# EAGLE design SmartLURE (EAGLE 6.5.0)
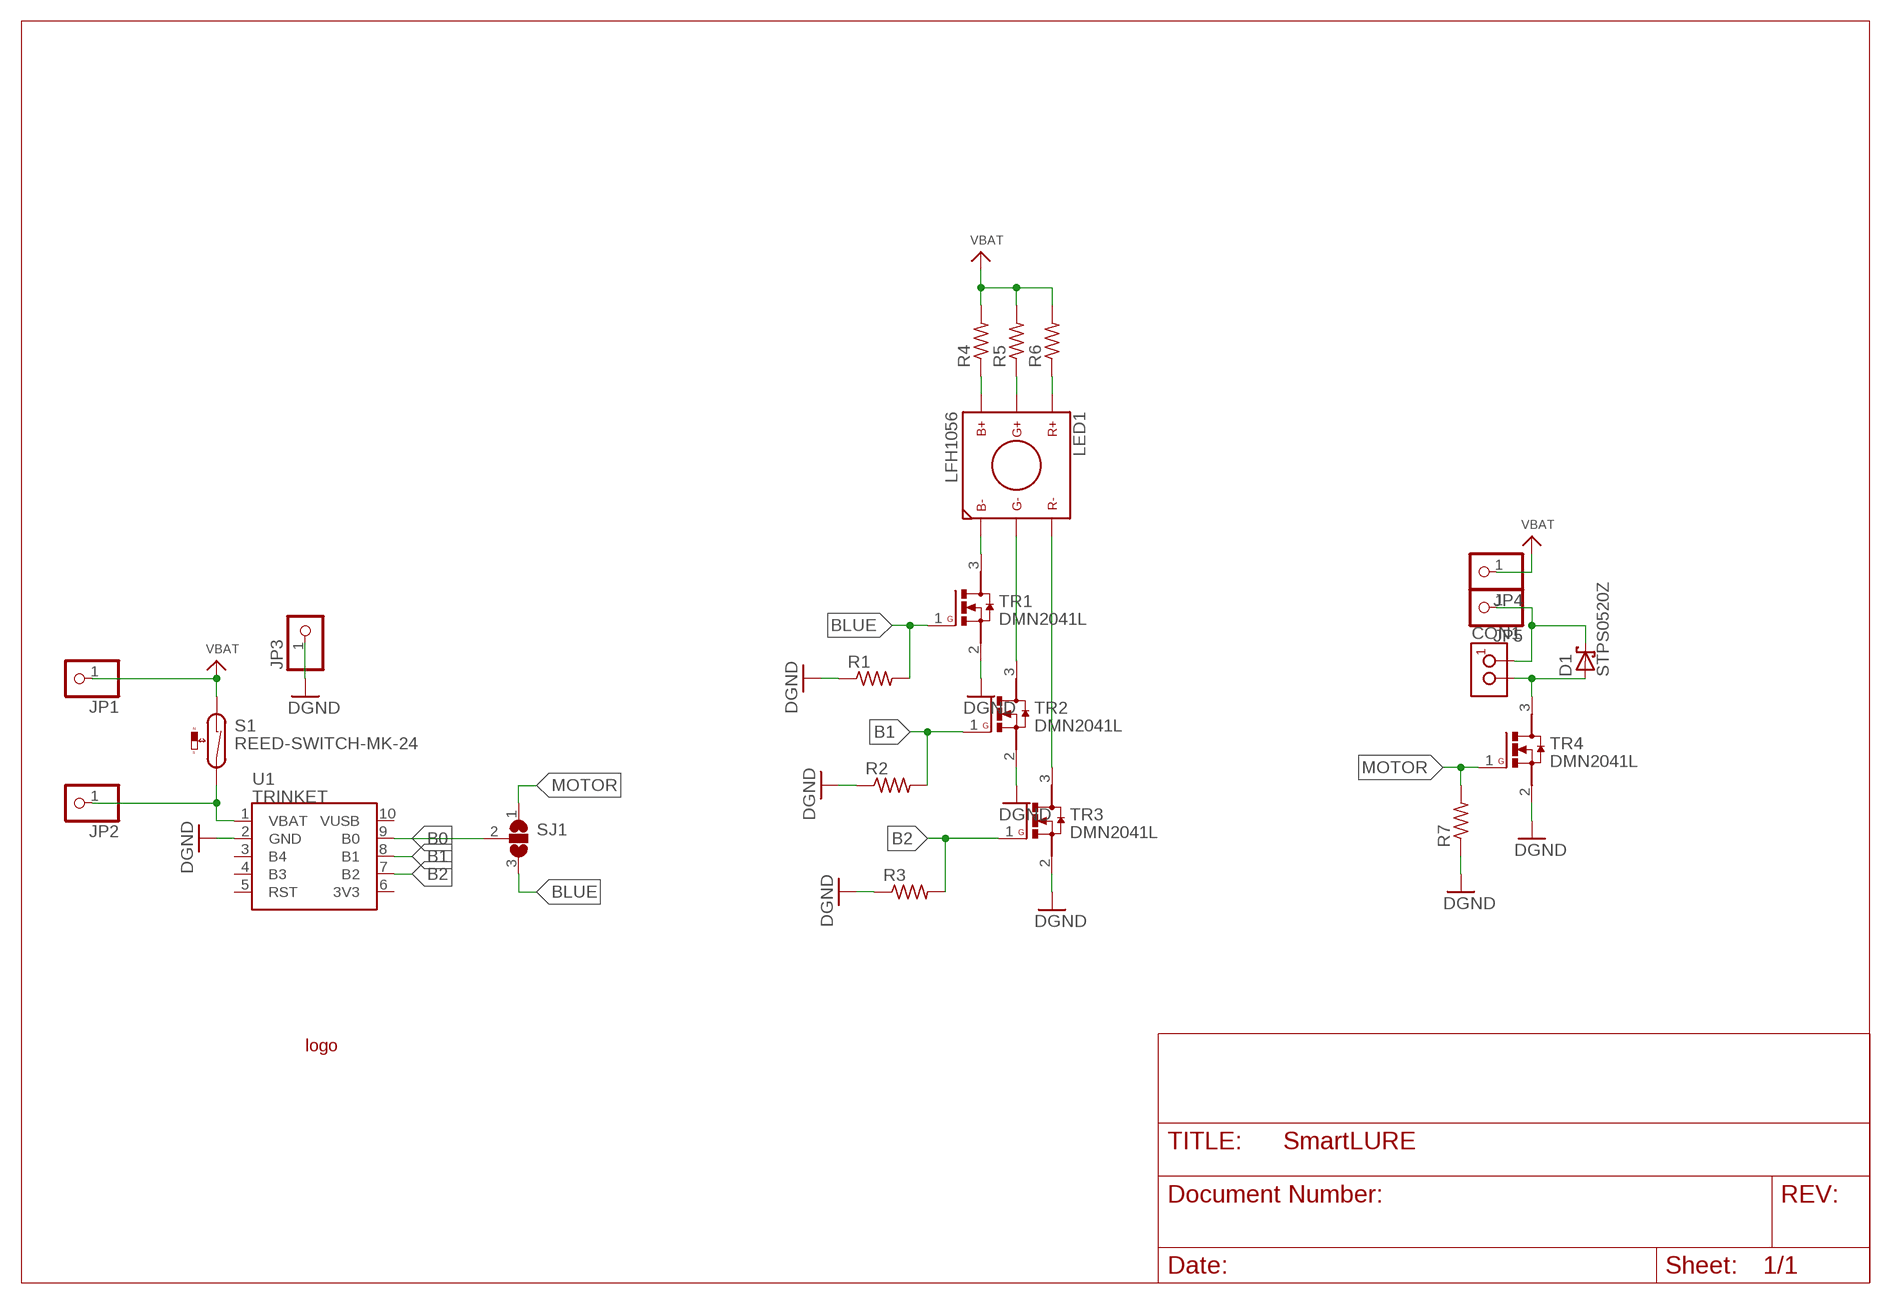
[diagram p0: schematic, sheet 1]

## Parts
CON1  PINHEADER_1.27  [PINHEADER_1.27]
D1  STPS0520Z  [SOD-123]
JP1  PINHD-1X1CB  [1X01-CLEANBIG]
JP2  PINHD-1X1CB  [1X01-CLEANBIG]
JP3  PINHD-1X1CB  [1X01-CLEANBIG]
JP4  PINHD-1X1CB  [1X01-CLEANBIG]
JP5  PINHD-1X1CB  [1X01-CLEANBIG]
LED1  LFH1056  [LFH1056]
LOGO1  GRADEFREELOGO-10  [GRADEFREELOGO-10]
R1  R0603(1608)  [R0603(1608)]
R2  R0603(1608)  [R0603(1608)]
R3  R0603(1608)  [R0603(1608)]
R4  R0603(1608)  [R0603(1608)]
R5  R0603(1608)  [R0603(1608)]
R6  R0603(1608)  [R0603(1608)]
R7  R0603(1608)  [R0603(1608)]
S1  REED-SWITCH-MK-24  [MK24]
SJ1  SJ2W  [SJ_2]
TR1  DMN2041L  [SOT23]
TR2  DMN2041L  [SOT23]
TR3  DMN2041L  [SOT23]
TR4  DMN2041L  [SOT23]
U1  TRINKET  [TRINKET]

## Nets
B0: SJ1.2 U1.9(B0)
B1: R2.2 TR2.1(G) U1.8(B1)
B2: R3.2 TR3.1(G) U1.7(B2)
BLUE: R1.2 SJ1.3 TR1.1(G)
DGND: JP3.1 R1.1 R2.1 R3.1 R7.1 TR1.2(S) TR2.2(S) TR3.2(S) TR4.2(S) U1.2(GND)
MOTOR: R7.2 SJ1.1 TR4.1(G)
N$1: LED1.B+ R4.1
N$2: LED1.G+ R5.1
N$3: LED1.R+ R6.1
N$4: LED1.B- TR1.3(D)
N$5: LED1.G- TR2.3(D)
N$6: LED1.R- TR3.3(D)
N$7: JP2.1 S1.2 U1.1(VBAT)
N$8: CON1.P$1 D1.C JP5.1
N$10: CON1.P$2 D1.A TR4.3(D)
VBAT: JP1.1 JP4.1 R4.2 R5.2 R6.2 S1.1
Unconnected: U1.3(B4) U1.4(B3) U1.5(RST) U1.6(3V3) U1.10(VUSB)

## Library data of the parts
CON1 = PinHeader:PINHEADER_1.27: 1.27mm pitch
D1 = GradeFreeEngineer:STPS0520Z: We use STPS0520Z by st.com diode for solar cell schottky diode. If = 500mA Vrrm = 20V Vf max = 0.32V
JP1-JP5 = adafruit:PINHD-1X1: Pin header 1x1 for 0.1" spacing With round pins
LED1 = GradeFreeEngineer:LFH1056: Luxpia LFH1056
LOGO1 = GradeFreeEngineer:GRADEFREELOGO
R1-R7 = GradeFreeEngineer:R
S1 = GradeFreeEngineer:REED-SWITCH-: Reed Sensor
SJ1 = jumper:SJ2W: SMD solder JUMPER
TR1-TR4 = GradeFreeEngineer:DMN2041L
U1 = GradeFreeEngineer:TRINKET

## Board
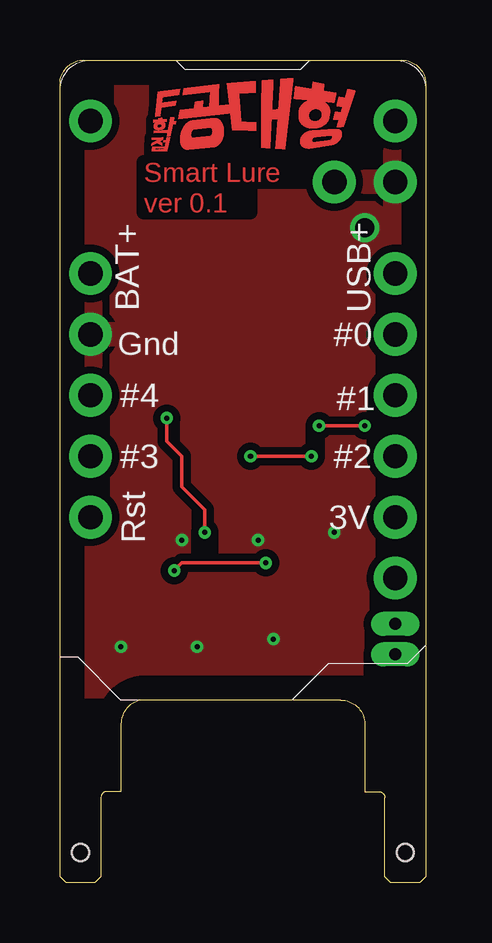
[diagram p1: board, top side]
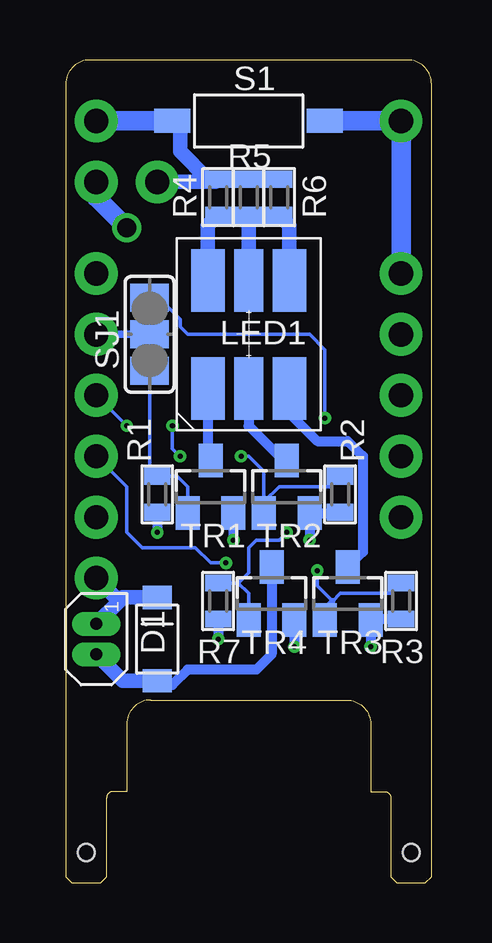
[diagram p2: board, bottom side, seen from below]

Size 15.24 x 34.29 mm. Coordinates in mm from the lower left corner, seen from the top.
Outline: 12.7,3.81 13.28,3.81 arc-90 13.54,3.56 13.54,0.25 13.79,0 14.99,0 15.24,0.25 15.24,33.29 arc90 14.24,34.29 1,34.29 arc90 0,33.29 0,0.25 0.25,0 1.45,0 1.71,0.25 1.71,3.56 arc-90 1.96,3.81 2.54,3.81 2.54,6.62 arc-90 3.54,7.62 11.7,7.62 arc-90 12.7,6.62 12.7,3.81
Copper layers (1*16): Top 0.035mm / dielectric 1.5mm / Bottom 0.035mm
Design rules "hsdgt": minimum track width 6mil, minimum drill 8mil, track to track 6mil, track to pad 6mil, pad to pad 6mil, via to via 6mil, smd to smd 6mil, copper to edge 40mil, drill to drill 8mil, minimum pad ring 10mil, minimum via ring 6mil, stop-mask expansion 4mil, vias tented up to drill 0mil, thermal gap 10mil
Holes 0.7 mm at 14.39,1.27 0.85,1.27

### Footprints (pad centres in the part's own frame; a part is rotated, then mirrored left to right if it is on the bottom)
PINHEADER_1.27 = drill 0.5 long: P$1 0,0; P$2 1.27,0
SOD-123 = smd 0.97 x 1.2: A -1.735,0; C 1.735,0
1X01-CLEANBIG = drill 1.016 pad 1.778: 1 0,0
LFH1056 = smd 2.6 x 1.4: B+ -2.25,-1.7; B- 2.25,-1.7; R+ -2.25,1.7; R- 2.25,1.7 | smd 2.6 x 1.2: G+ -2.25,0; G- 2.25,0
R0603(1608) = smd 0.7 x 1.1: 1 -0.75,0; 2 0.75,0
MK24 = smd 1.5 x 1: 1 -3.175,0; 2 3.175,0
SJ_2 = smd 1.168 x 1.6: 1 -1.524,0; 2 0,0; 3 1.524,0
SOT23 = smd 1 x 1.4: 1 -0.95,-1.1; 2 0.95,-1.1; 3 0,1.1
TRINKET = drill 1.016 pad 1.778: 1 -6.35,3.81; 2 -6.35,1.27; 3 -6.35,-1.27; 4 -6.35,-3.81; 5 -6.35,-6.35; 6 6.35,-6.35; 7 6.35,-3.81; 8 6.35,-1.27; 9 6.35,1.27; 10 6.35,3.81

### Placement (x,y rotation side)
CON1  13.97,10.79 270 bottom
D1  11.43,10.16 90 bottom
JP1  13.97,31.75 0 bottom
JP2  1.27,31.75 0 bottom
JP3  13.97,29.21 0 bottom
JP4  11.43,29.21 0 bottom
JP5  13.97,12.7 0 bottom
LED1  7.62,22.86 270 bottom
LOGO1  3.81,30.48 0 top
R1  11.43,16.19 90 bottom
R2  3.81,16.19 90 bottom
R3  1.27,11.75 90 bottom
R4  8.89,28.57 90 bottom
R5  7.62,28.57 90 bottom
R6  6.35,28.57 90 bottom
R7  8.89,11.75 90 bottom
S1  7.62,31.75 0 bottom
SJ1  11.75,22.86 270 bottom
TR1  9.21,16.51 0 bottom
TR2  6.03,16.51 0 bottom
TR3  3.49,12.06 0 bottom
TR4  6.67,12.06 0 bottom
U1  7.62,21.59 0 top

### Tracks (layer width: path | path; a pad name or v marks a point on that pad's centre or on a via)
B0
  Bottom 0.305: U1.9 SJ1.2
B1  (via drill 0.21)
  Top 0.152: v12.7,19.05 v10.79,19.05 | v10.48,17.78 v7.94,17.78
  Bottom 0.152: 6.98,15.88 6.35,16.51 4.24,16.51 R2.2 | U1.8 v12.7,19.05 | v10.79,19.05 10.79,18.1 v10.48,17.78 | v7.94,17.78 7.62,17.78 6.99,17.14 TR2.1
  Bottom 0.254: 6.98,15.88 TR2.1
B2  (via drill 0.21)
  Top 0.152: v8.57,13.34 5.08,13.34 v4.76,13.02
  Bottom 0.152: R3.2 1.7,12.06 3.81,12.06 4.13,11.75 4.76,12.38 v4.76,13.02 | U1.7 12.7,16.51 12.7,14.61 12.07,13.97 9.84,13.97 9.21,13.34 v8.57,13.34
  Bottom 0.254: TR3.1 4.44,11.43 4.13,11.75
BLUE
  Bottom 0.152: TR1.1 10.16,16.51 10.59,16.94 R1.2 11.75,17.26 SJ1.3
  Bottom 0.254: TR1.1
DGND  (via drill 0.21, 0.21 pad 0.51, 0.8)
  Bottom 0.406: TR4.2 v5.72,9.85 v5.71,9.84 | v2.54,9.84 v2.54,9.85 TR3.2 2.51,11 R3.1 | TR1.2 8.26,14.61 v8.26,14.29 | v5.08,14.29 TR2.2 3.53,15.41 R2.1 | R1.1 v11.43,14.61 | R7.1 v8.89,10.16
  Bottom 0.813: JP3.1 13.97,28.57 v12.7,27.3
  pour Top (isolate 0.305): 15.24,1.27 15.24,34.29 0,34.29 0,1.27
MOTOR  (via drill 0.21)
  Top 0.152: v4.45,19.37 4.45,18.41 5.08,17.78 5.08,16.51 6.03,15.56 v6.03,14.61
  Bottom 0.152: R7.2 8.05,12.5 | 8.05,12.5 7.62,12.06 TR4.1 | SJ1.1 11.37,24.38 10.48,23.5 10.48,23.18 10.16,22.86 5.08,22.86 4.45,22.23 v4.45,19.37 | v6.03,14.61 6.35,14.29 7.3,14.29 7.62,13.97 7.62,12.93 8.05,12.5
  Bottom 0.254: TR4.1
N$1
  Bottom 0.61: LED1.B+ 9.32,27.39 R4.1
N$2
  Bottom 0.61: LED1.G+ R5.1
N$3
  Bottom 0.61: LED1.R+ 5.92,27.39 R6.1
N$4
  Bottom 0.406: LED1.B- 9.32,17.72 TR1.3
N$5
  Bottom 0.406: LED1.G- 7.62,19.05 6.18,17.61 TR2.3
N$6
  Bottom 0.406: LED1.R- 5.92,19.57 4.76,18.41 3.49,18.41 2.86,17.78 2.86,13.8 TR3.3
N$7
  Bottom 0.813: S1.2 JP2.1 U1.1
N$8
  Bottom 0.61: D1.C 12.87,11.89 13.02,11.75 | 13.02,11.75 CON1.P$1 | JP5.1 13.02,11.75
N$10
  Bottom 0.406: TR4.3 6.67,9.53 7.3,8.89 10.16,8.89 10.79,8.26 11.26,8.26
  Bottom 0.61: CON1.P$2 12.87,8.43 D1.A 11.26,8.26
VBAT
  Bottom 0.61: R6.2 R5.2 R4.2 | R4.2 9.32,29.32 10.48,30.48 10.48,31.43 S1.1 | JP4.1 9.01,29.21 R4.2
  Bottom 0.813: S1.1 JP1.1

### Text on the board
Top: Smart Lure | ver 0.1
tStop: Smart Lure | ver 0.1